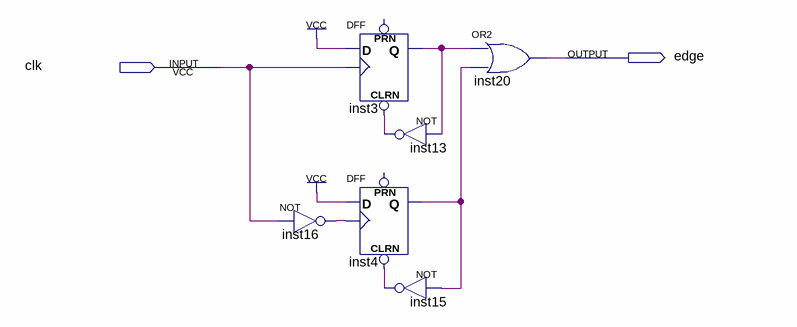
[diagram p0: schematic sheet]
// Quartus schematic EdgeCheck.bdf as structural Verilog: 6 symbols, 2 pins
module EdgeCheck (
  input  clk,
  output \edge 
);

  wire inst3_q, inst4_q, inst13_out, inst15_out, inst16_out;

  not inst16 (inst16_out, clk);
  DFF inst3 (.CLRN(inst13_out), .CLK(clk), .D(1'b1), .Q(inst3_q));  // open: PRN
  not inst13 (inst13_out, inst3_q);
  DFF inst4 (.CLRN(inst15_out), .CLK(inst16_out), .D(1'b1), .Q(inst4_q));  // open: PRN
  not inst15 (inst15_out, inst4_q);
  or inst20 (\edge , inst3_q, inst4_q);
endmodule
